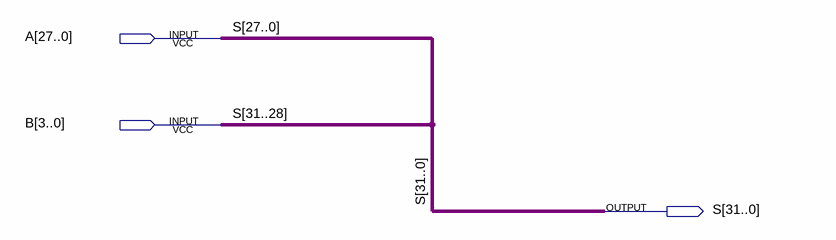
[diagram p0: schematic sheet]
// Quartus schematic MergeJump.bdf as structural Verilog: 0 symbols, 3 pins
module MergeJump (
  input  [27:0] A,
  input  [3:0] B,
  output [31:0] S
);


  assign S = {B, A};
endmodule
